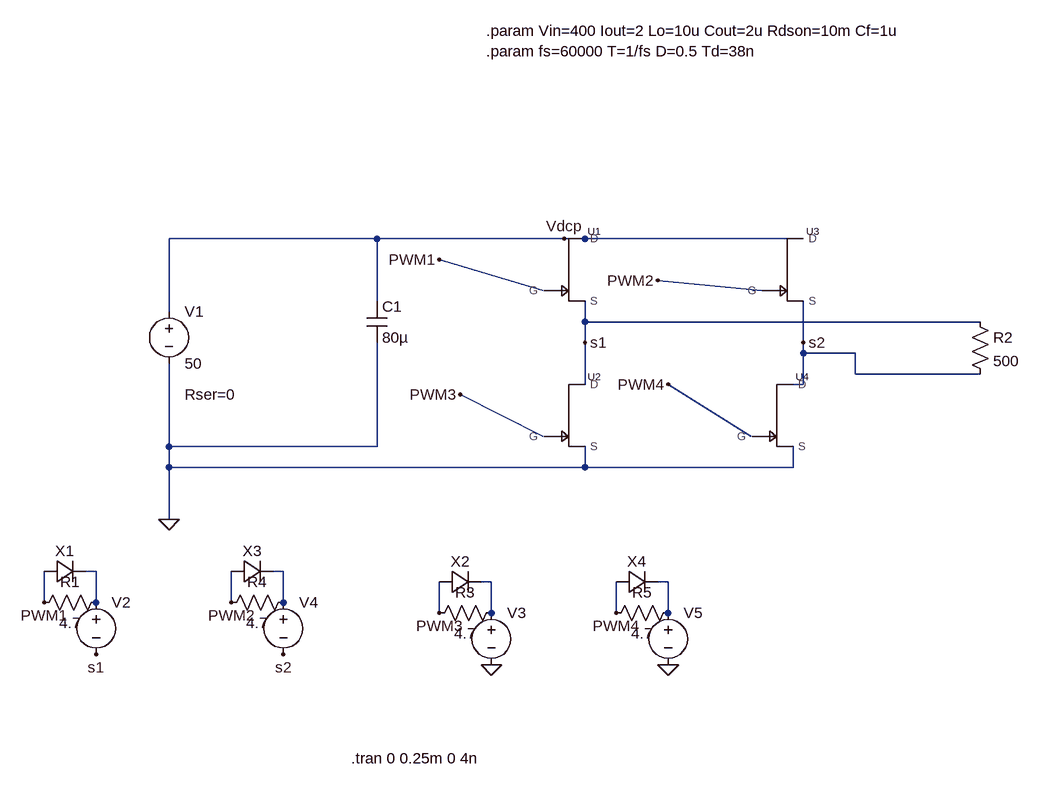
[diagram p0: schematic Unfolder.asc]
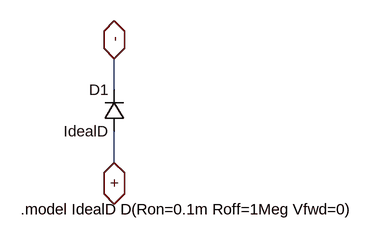
[diagram p1: sub-circuit idealdiode.asc]
Unfolder.asc, the LTspice schematic file:
Version 4
SHEET 1 2332 800
WIRE 96 -128 -224 -128
WIRE 384 -128 96 -128
WIRE 416 -128 384 -128
WIRE 752 -128 416 -128
WIRE 352 -48 192 -96
WIRE 688 -48 528 -64
WIRE 96 -32 96 -128
WIRE -224 -16 -224 -128
WIRE 416 0 416 -32
WIRE 1024 0 416 0
WIRE 416 32 416 0
WIRE 752 32 752 -32
WIRE 752 48 752 32
WIRE 832 48 752 48
WIRE 832 80 832 48
WIRE 1024 80 832 80
WIRE 416 96 416 32
WIRE 752 96 752 48
WIRE 752 96 736 96
WIRE 352 176 224 112
WIRE 672 176 544 96
WIRE -224 192 -224 64
WIRE 96 192 96 32
WIRE 96 192 -224 192
WIRE -224 224 -224 192
WIRE 416 224 416 192
WIRE 416 224 -224 224
WIRE 736 224 736 192
WIRE 736 224 416 224
WIRE -224 304 -224 224
WIRE -336 384 -352 384
WIRE -48 384 -64 384
WIRE 272 400 256 400
WIRE 544 400 528 400
WIRE -416 432 -416 384
WIRE -336 432 -336 384
WIRE -128 432 -128 384
WIRE -48 432 -48 384
WIRE 192 448 192 400
WIRE 272 448 272 400
WIRE 464 448 464 400
WIRE 544 448 544 400
FLAG -224 304 0
FLAG -416 432 PWM1
FLAG -336 512 s1
FLAG 192 -96 PWM1
FLAG 544 96 PWM4
FLAG 528 -64 PWM2
FLAG 224 112 PWM3
FLAG 192 448 PWM3
FLAG -128 432 PWM2
FLAG -48 512 s2
FLAG 464 448 PWM4
FLAG 416 32 s1
FLAG 752 32 s2
FLAG 272 528 0
FLAG 544 528 0
FLAG 384 -128 Vdcp
SYMBOL voltage -336 416 R0
WINDOW 3 24 96 Invisible 2
WINDOW 123 0 0 Left 0
WINDOW 39 0 0 Left 0
SYMATTR Value PULSE(0 5 0 1n 1n {D*T} {T})
SYMATTR InstName V2
SYMBOL res -320 416 R90
WINDOW 0 0 56 VBottom 2
WINDOW 3 32 56 VTop 2
SYMATTR InstName R1
SYMATTR Value 4.7
SYMBOL IdealDiode -416 400 R270
WINDOW 0 32 32 VTop 2
SYMATTR InstName X1
SYMBOL voltage -224 -32 R0
WINDOW 123 0 0 Left 0
WINDOW 39 24 144 Left 2
SYMATTR InstName V1
SYMATTR Value 50
SYMATTR SpiceLine Rser=0
SYMBOL GaN_LTspice_GS66516T_L1V4P1 368 -80 R0
WINDOW 3 -123 -87 Invisible 2
SYMATTR InstName U1
SYMBOL GaN_LTspice_GS66516T_L1V4P1 368 144 R0
WINDOW 3 -123 -87 Invisible 0
SYMATTR InstName U2
SYMBOL GaN_LTspice_GS66516T_L1V4P1 704 -80 R0
WINDOW 3 -123 -87 Invisible 2
SYMATTR InstName U3
SYMBOL GaN_LTspice_GS66516T_L1V4P1 688 144 R0
WINDOW 3 -123 -86 Invisible 2
SYMATTR InstName U4
SYMBOL res 1008 -16 R0
SYMATTR InstName R2
SYMATTR Value 500
SYMBOL voltage 272 432 R0
WINDOW 3 24 96 Invisible 2
WINDOW 123 0 0 Left 0
WINDOW 39 0 0 Left 0
SYMATTR Value PULSE(0 5 {D*T + Td} 1n 1n {D*T-2*Td} {T})
SYMATTR InstName V3
SYMBOL res 288 432 R90
WINDOW 0 0 56 VBottom 2
WINDOW 3 32 56 VTop 2
SYMATTR InstName R3
SYMATTR Value 4.7
SYMBOL IdealDiode 192 416 R270
WINDOW 0 32 32 VTop 2
SYMATTR InstName X2
SYMBOL voltage -48 416 R0
WINDOW 3 24 96 Invisible 2
WINDOW 123 0 0 Left 0
WINDOW 39 0 0 Left 0
SYMATTR Value PULSE(0 5 {D*T + Td} 1n 1n {D*T - 2*Td} {T})
SYMATTR InstName V4
SYMBOL res -32 416 R90
WINDOW 0 0 56 VBottom 2
WINDOW 3 32 56 VTop 2
SYMATTR InstName R4
SYMATTR Value 4.7
SYMBOL IdealDiode -128 400 R270
WINDOW 0 32 32 VTop 2
SYMATTR InstName X3
SYMBOL voltage 544 432 R0
WINDOW 3 24 96 Invisible 2
WINDOW 123 0 0 Left 0
WINDOW 39 0 0 Left 0
SYMATTR Value PULSE(0 5 0 1n 1n {D*T} {T})
SYMATTR InstName V5
SYMBOL res 560 432 R90
WINDOW 0 0 56 VBottom 2
WINDOW 3 32 56 VTop 2
SYMATTR InstName R5
SYMATTR Value 4.7
SYMBOL IdealDiode 464 416 R270
WINDOW 0 32 32 VTop 2
SYMATTR InstName X4
SYMBOL cap 80 -32 R0
SYMATTR InstName C1
SYMATTR Value 80µ
SYMATTR SpiceLine Rser=1m
TEXT 264 -448 Left 2 !.param Vin=400 Iout=2 Lo=10u Cout=2u Rdson=10m Cf=1u\n.param fs=60000 T=1/fs D=0.5 Td=38n
TEXT 56 672 Left 2 !.tran 0 0.25m 0 4n

idealdiode.asc, the sub-circuit schematic file:
Version 4
SHEET 1 880 680
WIRE 336 144 336 96
WIRE 336 256 336 208
FLAG 336 96 -
IOPIN 336 96 BiDir
FLAG 336 256 +
IOPIN 336 256 BiDir
SYMBOL diode 352 208 R180
WINDOW 0 24 64 Left 2
WINDOW 3 24 0 Left 2
SYMATTR InstName D1
SYMATTR Value IdealD
TEXT 192 328 Left 2 !.model IdealD D(Ron=0.1m Roff=1Meg Vfwd=0)

The netlist it stands for:
* Unfolder.asc
V2 N001 s1 PULSE(0 5 0 1n 1n {D*T} {T})
R1 N001 PWM1 4.7
XX1 PWM1 N001 idealdiode
V1 Vdcp 0 50 Rser=0
XU1 PWM1 Vdcp s1 GaN_LTspice_GS66516T_L1V4P1  ; pins G D S
XU2 PWM3 s1 0 GaN_LTspice_GS66516T_L1V4P1  ; pins G D S
XU3 PWM2 Vdcp s2 GaN_LTspice_GS66516T_L1V4P1  ; pins G D S
XU4 PWM4 s2 0 GaN_LTspice_GS66516T_L1V4P1  ; pins G D S
R2 s1 s2 500
V3 N003 0 PULSE(0 5 {D*T + Td} 1n 1n {D*T-2*Td} {T})
R3 N003 PWM3 4.7
XX2 PWM3 N003 idealdiode
V4 N002 s2 PULSE(0 5 {D*T + Td} 1n 1n {D*T - 2*Td} {T})
R4 N002 PWM2 4.7
XX3 PWM2 N002 idealdiode
V5 N004 0 PULSE(0 5 0 1n 1n {D*T} {T})
R5 N004 PWM4 4.7
XX4 PWM4 N004 idealdiode
C1 Vdcp 0 80µ Rser=1m

* block symbol definitions
.subckt idealdiode + -
D1 + - IdealD
.model IdealD D(Ron=0.1m Roff=1Meg Vfwd=0)
.ends idealdiode

.model D D
.lib standard.dio
.param Vin=400 Iout=2 Lo=10u Cout=2u Rdson=10m Cf=1u
.param fs=60000 T=1/fs D=0.5 Td=38n
.tran 0 0.25m 0 4n
.lib GaN_LTspice_GS66516T_L1V4P1.lib
.backanno
.end

* Results of the author's LTspice run, read from the files saved beside the schematic
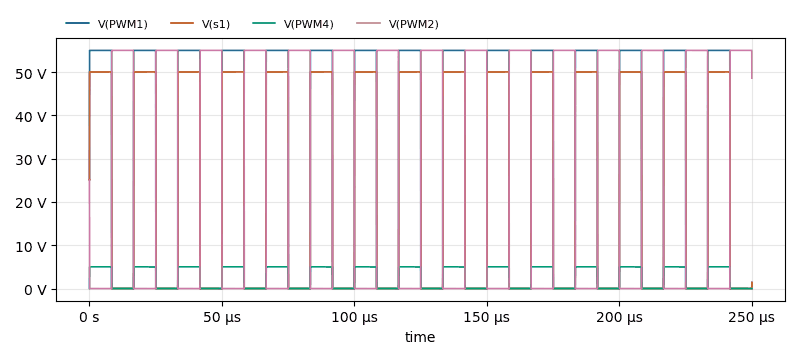
[diagram p2: Transient Analysis of Unfolder.asc, plotted from the saved traces]
* Transient Analysis, 1 run:
*   V(PWM1): min -66.82 mV, max 55 V, average 27.61 V, rms 38.95 V, last 1.391 V
*   V(s1): min -67.21 mV, max 50.07 V, average 25.11 V, rms 35.43 V, last 1.397 V
*   V(PWM4): min -6.076 mV, max 5 V, average 2.497 V, rms 3.532 V, last -6.075 mV
*   V(PWM2): min -66.82 mV, max 55 V, average 27.36 V, rms 38.77 V, last 48.6 V